# EAGLE design speedmeter (EAGLE 7.6.0)
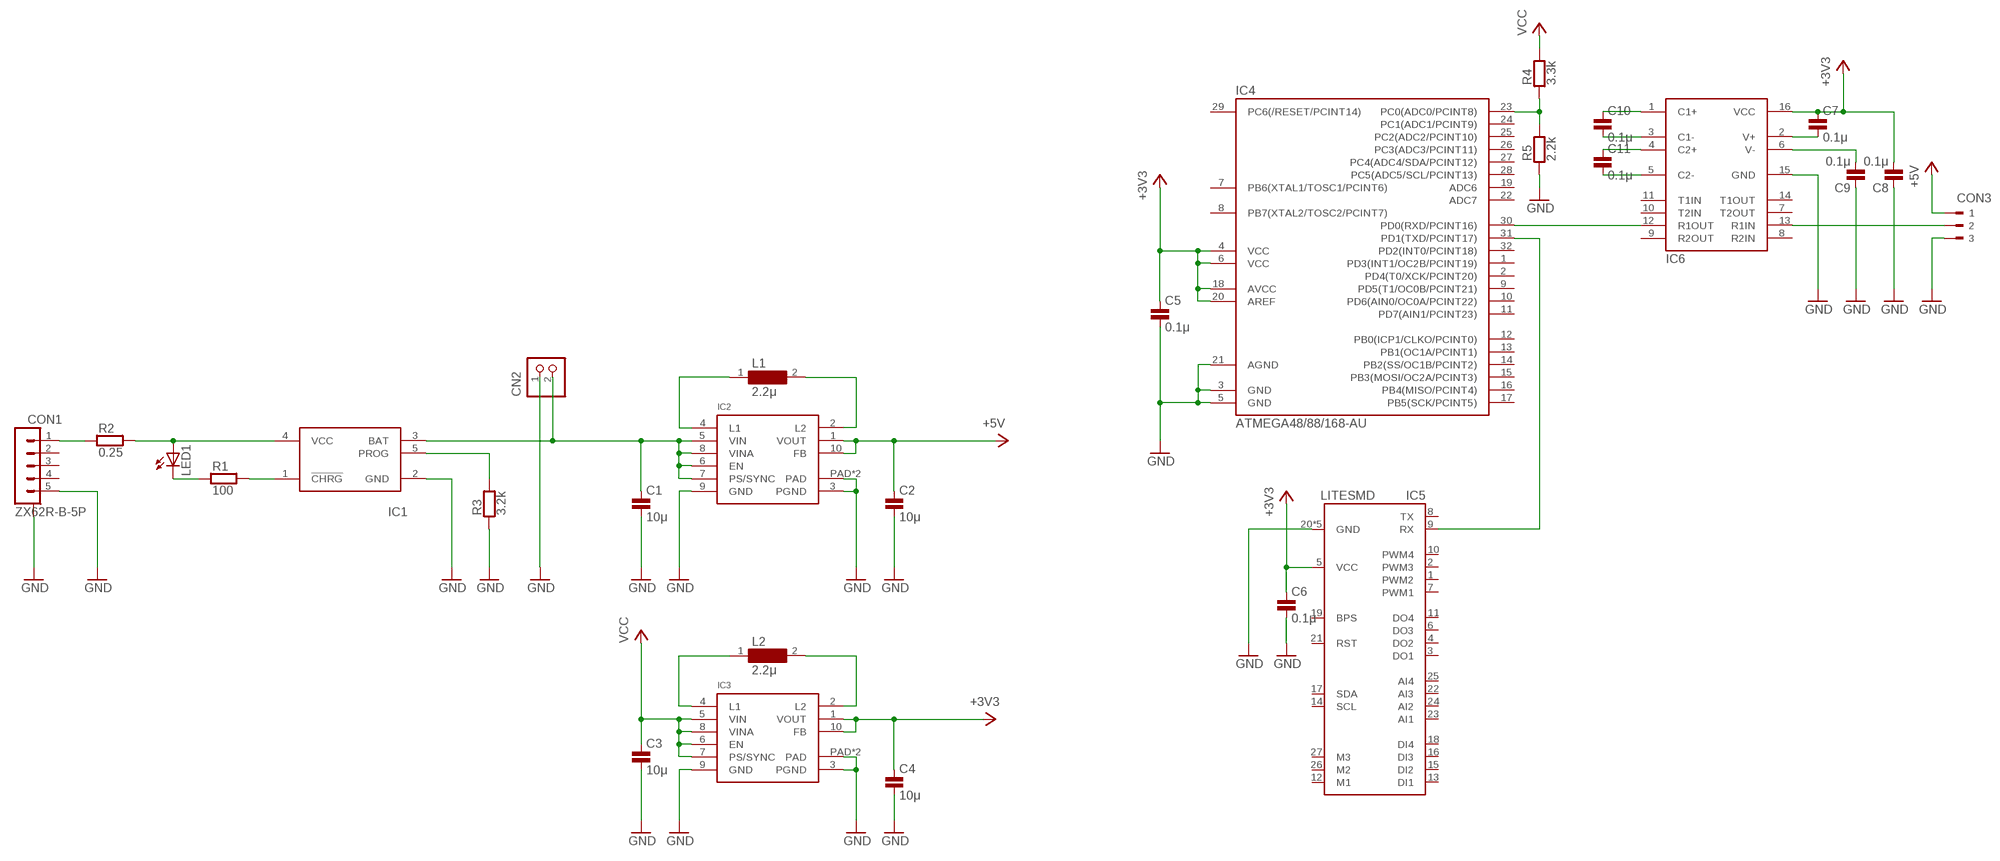
[diagram p0: schematic, sheet 1]

## Parts
C1  10μ  C0603  [0603]
C2  10μ  C0603  [0603]
C3  10μ  C0603  [0603]
C4  10μ  C0603  [0603]
C5  0.1μ  C0603  [0603]
C6  0.1μ  C0603  [0603]
C7  0.1μ  C0603  [0603]
C8  0.1μ  C0603  [0603]
C9  0.1μ  C0603  [0603]
C10  0.1μ  C0603  [0603]
C11  0.1μ  C0603  [0603]
CN2  S2B-PH-K-S  [S2B-PH-K-S]
CON1  ZX62R-B-5P  [MICRO-B]
CON3  180-3  [180-3]
IC1  LTC4054  [TSOT23-5]
IC2  TPS6300XDRCT  [S-PVSON-N10]
IC3  TPS6300XDRCT  [S-PVSON-N10]
IC4  ATMEGA48/88/168-AU  [TQFP32-08]
IC5  LITESMD  [LITE]
IC6  ADM3202ARN  [SOP16]
L1  2.2μ  VLF4012ST  [VLF4012ST]
L2  2.2μ  VLF4012ST  [VLF4012ST]
LED1  LEDSML0603  [SML0603]
R1  100  R0603  [0603]
R2  0.25  R0603  [0603]
R3  3.2k  R0603  [0603]
R4  3.3k  R0603  [0603]
R5  2.2k  R0603  [0603]

## Nets
+3V3: C4.1 C5.1 C6.1 C7.1 C8.2 IC3.1(VOUT) IC3.10(FB) IC4.4(VCC) IC4.6(VCC) IC4.18(AVCC) IC4.20(AREF) IC5.5(VCC) IC6.16(VCC)
+5V: C2.1 CON3.1 IC2.1(VOUT) IC2.10(FB)
GND: C1.2 C2.2 C3.2 C4.2 C5.2 C6.2 C8.1 C9.1 CN2.1 CON1.5(1.VBUS) CON1.CASE@1 CON1.CASE@2 CON1.CASE@3 CON1.CASE@4 CON3.3 IC1.2(GND) IC2.3(PGND) IC2.9(GND) IC2.PAD IC2.PAD@1(PAD) IC3.3(PGND) IC3.9(GND) IC3.PAD IC3.PAD@1(PAD) IC4.3(GND) IC4.5(GND) IC4.21(AGND) IC5.20(GND) IC5.28(GND) IC5.30(GND) IC5.31(GND) IC5.32(GND) IC6.15(GND) R3.1 R5.1
N$1: CON1.1(5.GND) R2.1
N$2: IC1.4(VCC) LED1.A R2.2
N$3: LED1.C R1.1
N$4: IC1.1(!CHRG!) R1.2
N$5: IC1.5(PROG) R3.2
N$7: IC2.4(L1) L1.1
N$8: IC2.2(L2) L1.2
N$9: CON3.2 IC6.13(R1IN)
N$10: IC3.4(L1) L2.1
N$11: IC3.2(L2) L2.2
N$12: IC4.23(PC0(ADC0/PCINT8)) R4.1 R5.2
N$13: IC4.31(PD1(TXD/PCINT17)) IC5.9(RX)
N$14: C7.2 IC6.2(V+)
N$15: C9.2 IC6.6(V-)
N$16: C10.1 IC6.1(C1+)
N$17: C10.2 IC6.3(C1-)
N$18: C11.1 IC6.4(C2+)
N$19: C11.2 IC6.5(C2-)
N$20: IC4.30(PD0(RXD/PCINT16)) IC6.12(R1OUT)
VCC: C1.1 C3.1 CN2.2 IC1.3(BAT) IC2.5(VIN) IC2.6(EN) IC2.7(PS/SYNC) IC2.8(VINA) IC3.5(VIN) IC3.6(EN) IC3.7(PS/SYNC) IC3.8(VINA) R4.2
Unconnected: CON1.2(4.ID) CON1.3(3.D+) CON1.4(2.D-) IC4.1(PD3(INT1/OC2B/PCINT19)) IC4.2(PD4(T0/XCK/PCINT20)) IC4.7(PB6(XTAL1/TOSC1/PCINT6)) IC4.8(PB7(XTAL2/TOSC2/PCINT7)) IC4.9(PD5(T1/OC0B/PCINT21)) IC4.10(PD6(AIN0/OC0A/PCINT22)) IC4.11(PD7(AIN1/PCINT23)) IC4.12(PB0(ICP1/CLKO/PCINT0)) IC4.13(PB1(OC1A/PCINT1)) IC4.14(PB2(SS/OC1B/PCINT2)) IC4.15(PB3(MOSI/OC2A/PCINT3)) IC4.16(PB4(MISO/PCINT4)) IC4.17(PB5(SCK/PCINT5)) IC4.19(ADC6) IC4.22(ADC7) IC4.24(PC1(ADC1/PCINT9)) IC4.25(PC2(ADC2/PCINT10)) IC4.26(PC3(ADC3/PCINT11)) IC4.27(PC4(ADC4/SDA/PCINT12)) IC4.28(PC5(ADC5/SCL/PCINT13)) IC4.29(PC6(/RESET/PCINT14)) IC4.32(PD2(INT0/PCINT18)) IC5.1(PWM2) IC5.2(PWM3) IC5.3(DO1) IC5.4(DO2) IC5.6(DO3) IC5.7(PWM1) IC5.8(TX) IC5.10(PWM4) IC5.11(DO4) IC5.12(M1) IC5.13(DI1) IC5.14(SCL) IC5.15(DI2) IC5.16(DI3) IC5.17(SDA) IC5.18(DI4) IC5.19(BPS) IC5.21(RST) IC5.22(AI3) IC5.23(AI1) IC5.24(AI2) IC5.25(AI4) IC5.26(M2) IC5.27(M3) IC6.7(T2OUT) IC6.8(R2IN) IC6.9(R2OUT) IC6.10(T2IN) IC6.11(T1IN) IC6.14(T1OUT)

## Library data of the parts
C1-C6 = untitled:C: CAPACITOR
C7-C11 = untitled-2:C: CAPACITOR
CN2 = jst-ph:S2B-PH-*: Wire-to-Board 2.0mm pitch side mount connector Source: http://www.jst-mfg.com/product/pdf/jpn/PH.pdf http://www.jst-mfg.com/product/detail.php?series=199
CON1 = untitled:ZX62R-B-5P
CON3 = con-weidmueller-sl35:180-3: WEIDMUELLER CLAMP CONNECTOR; OC_FARNELL: unknown; OC_NEWARK: unknown
IC1 = untitled:LTC4054
IC2 IC3 = untitled:TPS6300XDRCT
IC4 = atmega8:ATMEGA48/88/168
IC5 = untitled:LITE
IC6 = untitled-2:ADM3202
L1 L2 = untitled:VLF4012ST
LED1 = led:LED: LED OSRAM: - CHIPLED LG R971, LG N971, LY N971, LG Q971, LY Q971, LO R971, LY R971 LH N974, LH R974 LS Q976, LO Q976, LY Q976 LO Q996 - Hyper CHIPLED LW Q18S LB Q993, LB Q99A, LB R99A - SideLED LS A670, LO A670, LY A670, LG A670, LP A670 LB A673, LV A673, LT A673, LW A673 LH A674 LY A675 LS A676, LA A676, LO A676, LY A676, LW A676 LS A679, LY A679, LG A679 - Hyper Micro SIDELED® LS Y876, LA Y876, LO Y876, LY Y876 LT Y87S - SmartLED LW L88C, LW L88S LB L89C, LB L89S, LG L890 LS L89K, LO L89K, LY L89K LS L896, LA L896, LO L896, LY L896 - TOPLED LS T670, LO T670, LY T670, LG T670, LP T670 LSG T670, LSP T670, LSY T670, LOP T670, LYG T670 LG T671, LOG T671, LSG T671 LB T673, LV T673, LT T673, LW T673 LH T674 LS T676, LA T676, LO T676, LY T676, LB T676, LH T676, LSB T676, LW T676 LB T67C, LV T67C, LT T67C, LS T67K, LO T67K, LY T67K, LW E67C LS E67B, LA E67B, LO E67B, LY E67B, LB E67C, LV E67C, LT E67C LW T67C LS T679, LY T679, LG T679 LS T770, LO T770, LY T770, LG T770, LP T770 LB T773, LV T773, LT T773, LW T773 LH T774 LS E675, LA E675, LY E675, LS T675 LS T776, LA T776, LO T776, LY T776, LB T776 LHGB T686 LT T68C, LB T68C - Hyper Mini TOPLED® LB M676 - Mini TOPLED Santana® LG M470 LS M47K, LO M47K, LY M47K Source: http://www.osram.convergy.de LUXEON: - LUMILED® LXK2-PW12-R00, LXK2-PW12-S00, LXK2-PW14-U00, LXK2-PW14-V00 LXK2-PM12-R00, LXK2-PM12-S00, LXK2-PM14-U00 LXK2-PE12-Q00, LXK2-PE12-R00, LXK2-PE12-S00, LXK2-PE14-T00, LXK2-PE14-U00 LXK2-PB12-K00, LXK2-PB12-L00, LXK2-PB12-M00, LXK2-PB14-N00, LXK2-PB14-P00, LXK2-PB14-Q00 LXK2-PR12-L00, LXK2-PR12-M00, LXK2-PR14-Q00, LXK2-PR14-R00 LXK2-PD12-Q00, LXK2-PD12-R00, LXK2-PD12-S00 LXK2-PH12-R00, LXK2-PH12-S00 LXK2-PL12-P00, LXK2-PL12-Q00, LXK2-PL12-R00 Source: www.luxeon.com KINGBRIGHT: KA-3528ASYC Source: www.kingbright.com
R1-R5 = untitled:R: RESISTOR

## Board
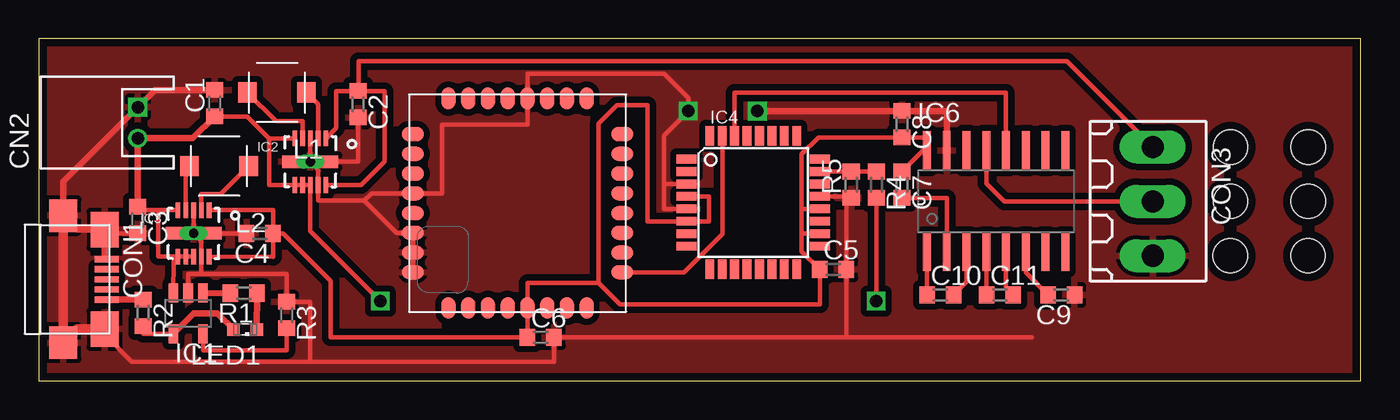
[diagram p1: board, top side]
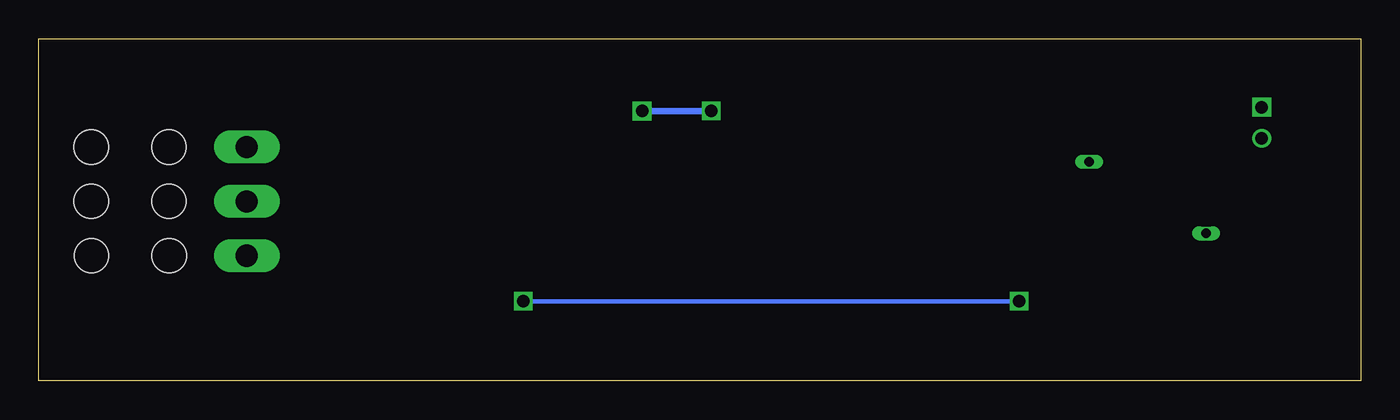
[diagram p2: board, bottom side, seen from below]

Size 85 x 22 mm. Coordinates in mm from the lower left corner, seen from the top.
Outline: 0,0 85,0 85,22 0,22 0,0
Copper layers (1*16): Top 0.035mm / dielectric 1.6mm / Bottom 0.035mm
Design rules "Elecrow_2-layer_PCB_eagle_rule": minimum track width 6mil, minimum drill 12mil, track to track 6mil, track to pad 6mil, pad to pad 6mil, via to via 8mil, smd to smd 0mil, copper to edge 20mil, drill to drill 10mil, minimum pad ring 6mil, minimum via ring 6mil, stop-mask expansion 0mil, vias tented up to drill 100mil, thermal gap 10mil
Holes 2.2 mm at 76.63,15.04 76.63,11.54 76.62,8.04 81.63,15.04 81.63,11.54 81.62,8.04

### Footprints (pad centres in the part's own frame; a part is rotated, then mirrored left to right if it is on the bottom)
0603 = smd 1 x 1.1: 1 -0.85,0; 2 0.85,0
S2B-PH-K-S = drill 0.8 square: 1 1,0 | drill 0.8: 2 -1,0
MICRO-B = smd 0.4 x 1.55: 1 1.3,2.775; 2 0.65,2.775; 3 0,2.775; 4 -0.65,2.775; 5 -1.3,2.775 | smd 2.3 x 1.8: CASE@1 -3.2,2.65; CASE@2 3.2,2.65 | smd 2.1 x 1.8: CASE@3 -4.1,0; CASE@4 4.075,0
180-3 = drill 1.422 long: 1 -3.5,0; 2 0,0; 3 3.5,0
TSOT23-5 = smd 0.62 x 1.22: 1 -0.95,-1.31; 2 0,-1.31; 3 0.95,-1.31; 4 0.95,1.31; 5 -0.95,1.31
S-PVSON-N10 = smd 0.3 x 1: 1 -1,-1.5; 2 -0.5,-1.5; 3 0,-1.5; 4 0.5,-1.5; 5 1,-1.5; 6 1,1.5; 7 0.5,1.5; 8 0,1.5; 9 -0.5,1.5; 10 -1,1.5 | smd 3.6 x 0.8: PAD 0,0 | drill 0.6 long: PAD@1 0,0
TQFP32-08 = smd 1.27 x 0.559: 1 -4.293,2.8; 2 -4.293,2; 3 -4.293,1.2; 4 -4.293,0.4; 5 -4.293,-0.4; 6 -4.293,-1.2; 7 -4.293,-2; 8 -4.293,-2.8; 17 4.293,-2.8; 18 4.293,-2; 19 4.293,-1.2; 20 4.293,-0.4; 21 4.293,0.4; 22 4.293,1.2; 23 4.293,2; 24 4.293,2.8 | smd 0.559 x 1.27: 9 -2.8,-4.293; 10 -2,-4.293; 11 -1.2,-4.293; 12 -0.4,-4.293; 13 0.4,-4.293; 14 1.2,-4.293; 15 2,-4.293; 16 2.8,-4.293; 25 2.8,4.293; 26 2,4.293; 27 1.2,4.293; 28 0.4,4.293; 29 -0.4,4.293; 30 -1.2,4.293; 31 -2,4.293; 32 -2.8,4.293
LITE = smd 1.4 x 0.9: 1 0.25,11.43; 2 0.25,10.16; 3 0.25,8.89; 4 0.25,7.62; 5 0.25,6.35; 6 0.25,5.08; 7 0.25,3.81; 8 0.25,2.54; 17 13.72,2.54; 18 13.72,3.81; 19 13.72,5.08; 20 13.72,6.35; 21 13.72,7.62; 22 13.72,8.89; 23 13.72,10.16; 24 13.72,11.43 | smd 0.9 x 1.4: 9 2.54,0.25; 10 3.81,0.25; 11 5.08,0.25; 12 6.35,0.25; 13 7.62,0.25; 14 8.89,0.25; 15 10.16,0.25; 16 11.43,0.25; 25 11.43,13.72; 26 10.16,13.72; 27 8.89,13.72; 28 7.62,13.72; 29 6.35,13.72; 30 5.08,13.72; 31 3.81,13.72; 32 2.54,13.72
SOP16 = smd 0.5 x 2.5: 1 -4.445,-3.25; 2 -3.175,-3.25; 3 -1.905,-3.25; 4 -0.635,-3.25; 5 0.635,-3.25; 6 1.905,-3.25; 7 3.175,-3.25; 8 4.445,-3.25; 9 4.445,3.25; 10 3.175,3.25; 11 1.905,3.25; 12 0.635,3.25; 13 -0.635,3.25; 14 -1.905,3.25; 15 -3.175,3.25; 16 -4.445,3.25
VLF4012ST = smd 1.2 x 1.3: 1 1.9,0; 2 -1.9,0
SML0603 = smd 0.8 x 0.8: A 0.75,0; C -0.75,0

### Placement (x,y rotation side)
C1  11.3,17.86 90 top
C2  20.54,17.79 270 top
C3  6.36,10.33 270 top
C4  14.21,9.47 180 top
C5  51.07,7.16 0 top
C6  32.27,2.78 0 top
C7  55.5,12.61 270 top
C8  55.5,16.51 270 top
C9  65.75,5.52 180 top
C10  57.97,5.51 0 top
C11  61.8,5.52 0 top
CN2  6.36,16.6 90 top
CON1  1.58,6.52 270 top
CON3  71.63,11.54 270 top
IC1  9.6,4.33 180 top
IC2  17.46,14.09 180 top
IC3  9.95,9.48 180 top
IC4  45.94,11.46 0 top
IC5  37.77,4.44 90 top
IC6  61.56,11.55 0 top
L1  15.31,18.55 180 top
L2  11.59,13.81 180 top
LED1  13.27,3.29 180 top
R1  13.18,5.63 180 top
R2  6.71,4.37 270 top
R3  15.93,4.23 270 top
R4  53.85,12.61 270 top
R5  52.24,12.61 90 top

### Tracks (layer width: path | path; a pad name or v marks a point on that pad's centre or on a via)
+3V3
  Top 0.305: IC3.10 15.06,7.97 C4.1 | IC3.1 15.06,10.97 C4.1 | 35.99,6.3 31.42,6.3 IC5.5 C6.1 18.76,2.78 18.76,6.42 15.71,9.47 C4.1 | 35.99,6.3 35.99,16.55 37.18,17.74 39.15,17.74 39.15,10.25 IC4.6 43.09,10.26 43.09,11.86 IC4.4 | 35.99,6.3 37.37,4.92 50.22,4.92 C5.1 49.05,8.33 49.04,8.33 49.04,9.46 | 49.04,9.46 IC4.18 | IC4.20 49.04,11.06 | 49.04,11.06 49.04,9.46 | 49.04,11.06 49.04,14.57 50.13,15.66 C8.2 57.12,15.66 IC6.16 56.84,14.8 C7.1
+5V
  Top 0.305: C2.1 22.22,18.64 22.23,14.1 20.72,12.59 IC2.10 | IC2.1 19.13,16.26 19.13,18.64 C2.1 | CON3.1 66.11,20.56 20.55,20.56 C2.1
GND  (via drill 0.8)
  Top 0.305: C3.2 4.23,9.48 CON1.CASE@1 | IC3.3 IC3.PAD@1 | IC3.PAD@1 10.45,8.98 IC3.9 10.44,6.87 | IC2.3 IC2.PAD@1 | IC2.PAD@1 17.96,13.59 IC2.9 17.96,11.59 20.93,11.59 | IC5.32 IC5.31 IC5.30 23,9.52 20.93,11.59 | IC4.3 40.19,12.66 | IC4.5 40.19,11.06 40.19,12.66 | 51.92,2.78 C6.2 33.12,1.22 17.45,1.22 | 51.92,2.78 C5.2 51.92,11.44 R5.1 52.14,11.86 IC4.21 | 63.86,2.78 51.92,2.78 | 20.93,11.59 21.4,12.06 IC5.28 25.92,12.06 25.92,16.47 31.42,16.47 IC5.20 31.42,19.77 40.19,19.77 41.77,18.19 v41.77,17.36 40.19,15.78 40.19,12.66 | IC1.2 9.6,6.87 10.44,6.87 | 10.44,6.87 15.93,6.87 R3.1 17.45,5.08 17.45,1.22 | 17.45,1.22 5.98,1.22 4.23,2.97 CON1.CASE@2 | C4.2 IC3.PAD@1 | C2.2 20.54,14.09 IC2.PAD@1
  Top 0.406: CON1.CASE@1 4.23,7.82 CON1.5 | 4.47,9.48 CON1.CASE@1 | v46.21,17.35 v46.21,17.36 C8.1 58.38,17.36 IC6.15 | C1.2 7.47,18.71 CN2.1 1.58,12.82 CON1.CASE@3 2.48,9.72 CON1.CASE@1
  Top 0.61: CON1.CASE@2 2.46,3.32 CON1.CASE@4 CON1.CASE@3
  Bottom 0.406: v46.21,17.35 v41.77,17.35 v41.77,17.36
  pour Top (isolate 0.406): 0,22 85,22 85,0 0,0
N$1
  Top 0.406: CON1.1 R2.1
N$2
  Top 0.305: R2.2 6.71,3.02 IC1.4
  Top 0.406: R2.2 | LED1.A 11.47,4.34 9.97,4.34 IC1.4
N$3
  Top 0.406: R1.1 LED1.C
N$4
  Top 0.406: R1.2 IC1.1
N$5
  Top 0.305: IC1.5 10.55,1.94 15.92,1.94 R3.2
N$7
  Top 0.305: IC2.4 16.96,16.7 15.26,16.7 L1.1
N$8
  Top 0.305: IC2.2 17.96,17.8 L1.2
N$9
  Top 0.305: IC6.13 60.92,12.7 62.09,11.54 CON3.2
N$10
  Top 0.305: IC3.4 9.45,13.57 L2.1
N$11
  Top 0.305: IC3.2 10.45,12.01 11.69,12.01 L2.2
N$12
  Top 0.305: IC4.23 R5.2 R4.1
N$13
  Top 0.305: IC5.9 41.49,6.98 43.95,9.44 IC4.31
N$14
  Top 0.305: IC6.2 58.38,11.76 C7.2
N$15
  Top 0.305: IC6.6 63.47,6.96 C9.2
N$16
  Top 0.305: IC6.1 C10.1
N$17
  Top 0.305: C10.2 59.66,6.34 IC6.3
N$18
  Top 0.305: IC6.4 60.92,5.52 C11.1
N$19
  Top 0.305: IC6.5 62.2,5.97 C11.2
N$20
  Top 0.305: IC4.30 44.74,18.53 62.19,18.53 IC6.12
VCC  (via drill 0.8)
  Top 0.305: IC3.6 IC3.7 IC3.8 | IC3.5 7.68,10.98 | 7.68,10.98 6.56,10.98 C3.1 | IC3.6 7.68,7.98 7.68,10.98 | 8.81,5.64 IC1.3 8.66,7.69 IC3.6 | 14.82,15.59 14.82,12.59 IC2.6 IC2.7 IC2.8 17.46,9.62 v21.97,5.11 | 14.82,15.59 IC2.5 | 14.82,15.59 13.4,17.01 C1.1 | v53.85,5.12 R4.2
  Top 0.406: C1.1 9.89,15.6 CN2.2 C3.1
  Bottom 0.305: v21.97,5.11 v53.85,5.11 v53.85,5.12